# EAGLE design Mutatio_REV2 (EAGLE 7.5.0)
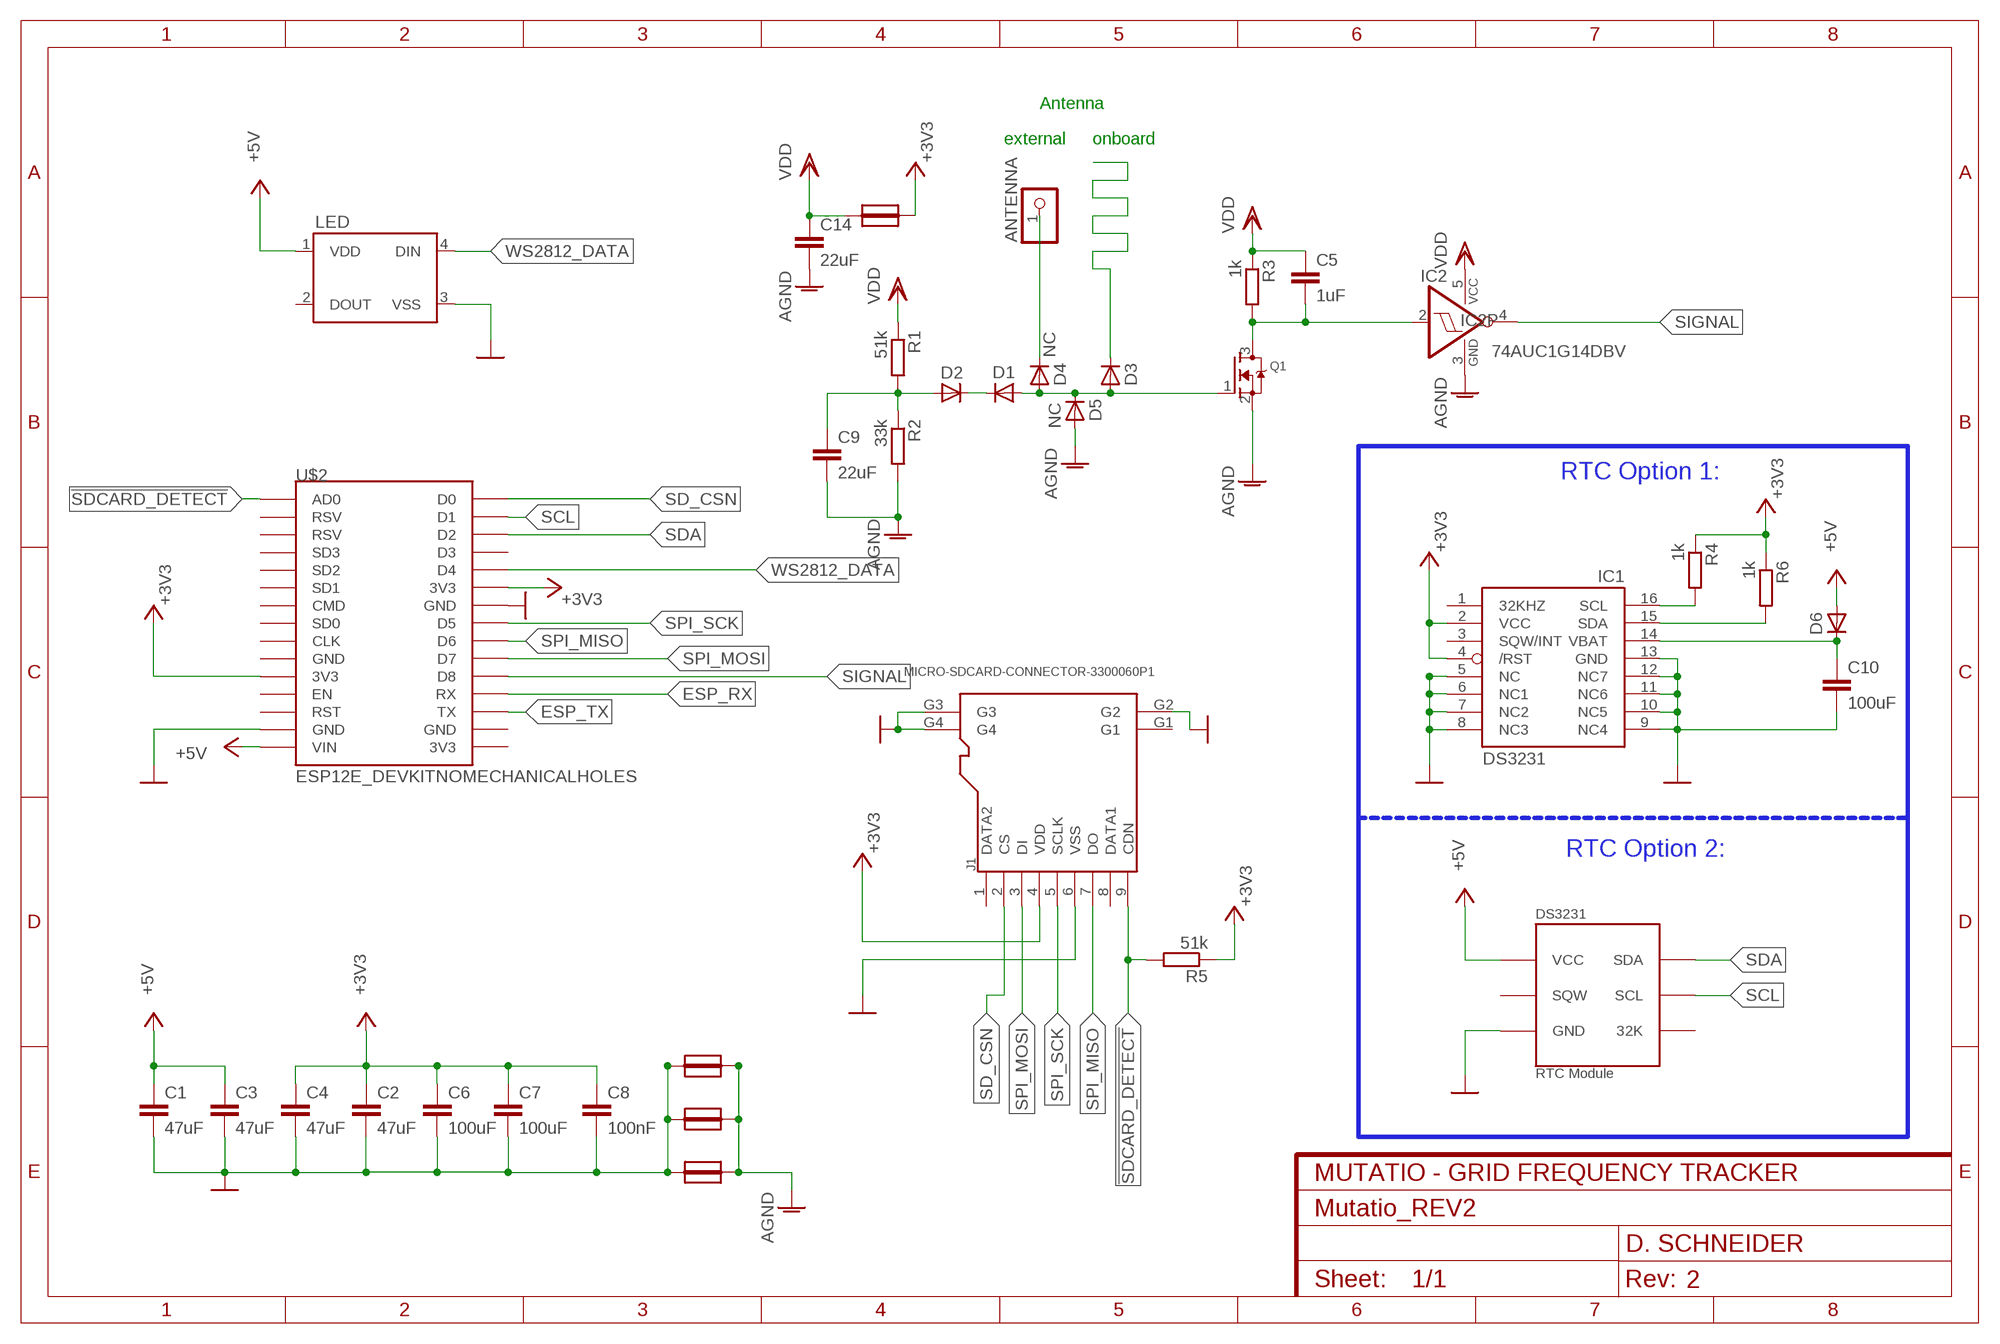
[diagram p0: schematic, sheet 1]
FRAME (FRAME-A4L): CNAME: MUTATIO - GRID FREQUENCY TRACKER; CREVISION: 2; DESIGNER: D. SCHNEIDER

## Parts
ANTENNA  PINHD-1X1CB  [1X01-CLEANBIG]
C1  47uF  C-EUC0805  [C0805]
C2  47uF  C-EUC0805  [C0805]
C3  47uF  C-EUC0805  [C0805]
C4  47uF  C-EUC0805  [C0805]
C5  1uF  C-EUC0603  [C0603]
C6  100uF  C-EUC1206  [C1206]
C7  100uF  C-EUC1206  [C1206]
C8  100nF  C-EUC0603  [C0603]
C9  22uF  C-EUC0603  [C0603]
C10  100uF  C-EUC1206  [C1206]
C14  22uF  C-EUC0603  [C0603]
D1  DIODE-MINIMELF  [MINIMELF]
D2  DIODE-MINIMELF  [MINIMELF]
D3  DIODE-MINIMELF  [MINIMELF]
D4  NC  DIODE-MINIMELF  [MINIMELF]
D5  NC  DIODE-MINIMELF  [MINIMELF]
D6  DIODE-MINIMELF  [MINIMELF]
IC1  DS3231/SO  [SO16W]
IC2  74AUC1G14DBV  [SOT23-5]
J1  MICRO-SDCARD-CONNECTOR-3300060P1  [9P-SMD-W-RING]
LED  WS2812B  [WS2812B]
Q1  MOSFET-NREFLOW  [SOT23]
R1  51k  R-EU_R0603  [R0603]
R2  33k  R-EU_R0603  [R0603]
R3  1k  R-EU_R0603  [R0603]
R4  1k  R-EU_R0603  [R0603]
R5  51k  R-EU_R0603  [R0603]
R6  1k  R-EU_R0603  [R0603]
U$1  DS3231_MODULEBIG_CONNECTER_ONLY  [DS3231_MODULE_BIGCON]
U$2  ESP12E_DEVKITNOMECHANICALHOLES  [ESP12E_DEVKIT_NOHOLES]
U$7  SHORT  [SHORT]
U$8  SHORT  [SHORT]
U$9  SHORT  [SHORT]
U$10  SHORT  [SHORT]

## Nets
!SDCARD_DETECT: J1.9(CDN) R5.2 U$2.AD0
+3V3: C2.1 C4.1 C6.1 C7.1 C8.1 IC1.2(VCC) IC1.4(/RST) J1.4(VDD) R4.1 R5.1 R6.1 U$2.3V3@0(3V3) U$2.3V3@1(3V3) U$7.P$2
+5V: C1.1 C3.1 D6.A LED.1(VDD) U$1.VCC@2(VCC) U$2.VIN
AGND: C9.2 C14.2 D5.A IC2.3(GND) Q1.2(S) R2.2 U$8.P$2 U$9.P$2 U$10.P$2
ANTENNA: D1.A D3.A D4.A D5.C Q1.1(G)
BOARDANTENNA: D3.C
ESP_RX: U$2.RX
ESP_TX: U$2.TX
GND: C1.2 C2.2 C3.2 C4.2 C6.2 C7.2 C8.2 C10.2 IC1.5(NC) IC1.6(NC1) IC1.7(NC2) IC1.8(NC3) IC1.9(NC4) IC1.10(NC5) IC1.11(NC6) IC1.12(NC7) IC1.13(GND) J1.6(VSS) J1.G2 J1.G3 J1.G4 LED.3(VSS) U$1.GND@2(GND) U$2.GND@1(GND) U$2.GND@2(GND) U$8.P$1 U$9.P$1 U$10.P$1
N$1: D1.C D2.C
N$3: ANTENNA.1 D4.C
N$4: C5.2 IC2.2(I) Q1.3(D) R3.2
N$6: C10.1 D6.C IC1.14(VBAT)
REF1: C9.1 D2.A R1.2 R2.1
SCL: IC1.16(SCL) R4.2 U$1.SCL@2(SCL) U$2.D1
SD_CSN: J1.2(CS) U$2.D0
SDA: IC1.15(SDA) R6.2 U$1.SDA@2(SDA) U$2.D2
SIGNAL: IC2.4(O) U$2.D8
SPI_MISO: J1.7(DO) U$2.D6
SPI_MOSI: J1.3(DI) U$2.D7
SPI_SCK: J1.5(SCLK) U$2.D5
VDD: C5.1 C14.1 IC2.5(VCC) R1.1 R3.1 U$7.P$1
WS2812_DATA: LED.4(DIN) U$2.D4
Unconnected: IC1.1(32KHZ) IC1.3(SQW/INT) J1.1(DATA2) J1.8(DATA1) J1.G1 LED.2(DOUT) U$1.32K U$1.SQW U$2.3V3@2(3V3) U$2.CLK U$2.CMD U$2.D3 U$2.EN U$2.GND@0(GND) U$2.GND@3(GND) U$2.RST U$2.RSV@0(RSV) U$2.RSV@1(RSV) U$2.SD0 U$2.SD1 U$2.SD2 U$2.SD3

## Notes on the sheet
- Antenna
- external | onboard
- RTC Option 1:
- RTC Option 2:

## Library data of the parts
ANTENNA = adafruit:PINHD-1X1: Pin header 1x1 for 0.1" spacing With round pins
C1-C10 C14 = resistor:C-EU: CAPACITOR, European symbol
D1-D6 = diode:DIODE-: DIODE
IC1 = adafruit:DS3231
IC2 = 74xx-little-de:74*1G14: Single Schmitt-Trigger Inverter Gate
J1 = OPL Eagle Library:MICRO-SDCARD-CONNECTOR: Micro SD Card
LED = SparkFun-LED:WS2812B: WS2812B - Intelligent control LED integrated light source Technical Specifications: Power Supply Voltage (VDD): 3.5 to 5.3 V Input Voltage (VI): -0.5 to VDD+0.5 V Operating Junction Temperature (Topt): -25°C to +80°C Storage Temperature Range (Tstg): -55°C to +150°C
Q1 = adafruit:MOSFET-N: N-Channel Mosfet 2N7002E - 60V 260mA SOT23 [Digikey: 2N7002ET1GOSTR-ND] - REEL BSH103 - 30V 850mA SOT23 [Digikey: 568-5013-1-ND]
R1-R6 = resistor:R-EU_: RESISTOR, European symbol
U$1 = DS3231_Module:DS3231_MODULE
U$2 = NODEMCU_ESP12E_DEVKIT:ESP12E_DEVKIT: ESP12E DEVKIT BOARD
U$7-U$10 = short_jumper:SHORT

## Board
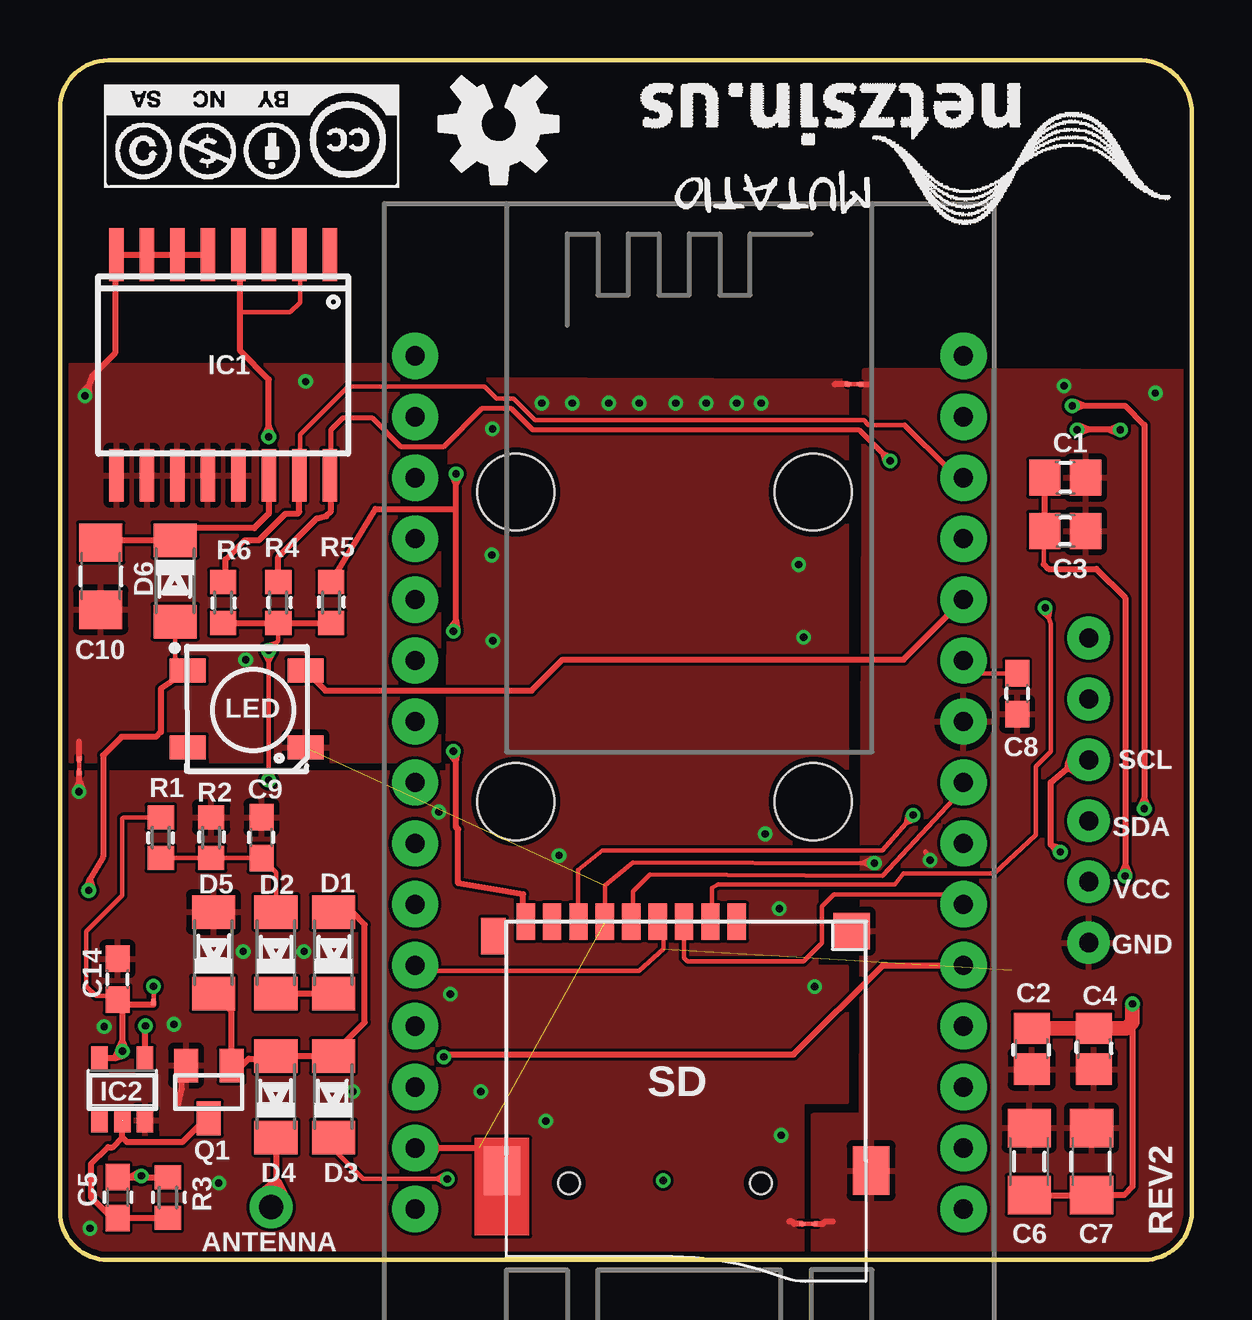
[diagram p1: board, top side]
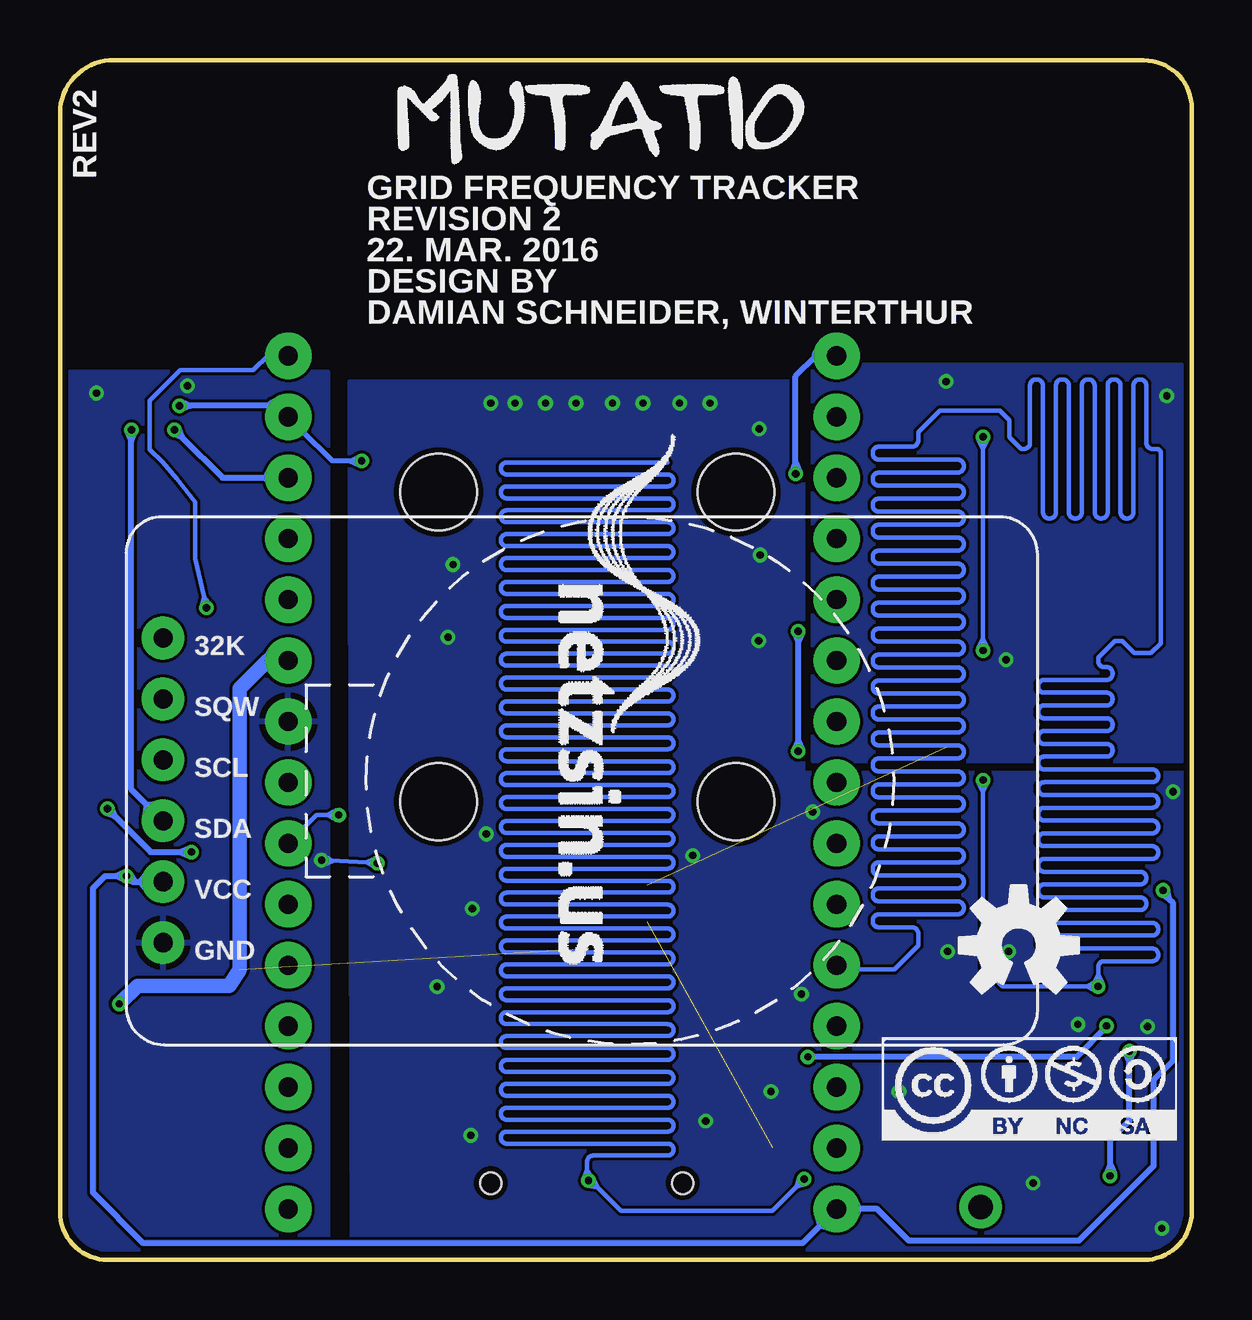
[diagram p2: board, bottom side, seen from below]

Size 47.18 x 50.01 mm. Coordinates in mm from the lower left corner, seen from the top.
Outline: 47.18,2 47.18,48 arc90 44.68,50 2,50 arc90 0,48 0,2 arc90 2,0 45.18,0 arc90 47.18,2
Copper layers (1*16): Top 0.035mm / dielectric 1.5mm / Bottom 0.035mm
Design rules "dirt_cheap_dirty_boards.v1": minimum track width 5mil, minimum drill 12mil, track to track 5mil, track to pad 5mil, pad to pad 5mil, via to via 5mil, smd to smd 0mil, copper to edge 10mil, drill to drill 10mil, minimum pad ring 10mil, minimum via ring 6mil, stop-mask expansion 2mil, vias tented up to drill 25mil, thermal gap 10mil
Holes 3.2 mm at 19,32 31.4,32 31.4,19.1 19,19.1

### Footprints (pad centres in the part's own frame; a part is rotated, then mirrored left to right if it is on the bottom)
1X01-CLEANBIG = drill 1.016 pad 1.778: 1 0,0
C0805 = smd 1.3 x 1.5: 1 -0.85,0; 2 0.85,0
C0603 = smd 1.1 x 1: 1 -0.85,0; 2 0.85,0
C1206 = smd 1.6 x 1.8: 1 -1.4,0; 2 1.4,0
MINIMELF = smd 1.4 x 1.8: A 1.7,0; C -1.7,0
SO16W = smd 0.6 x 2.2: 1 -4.445,-4.6; 2 -3.175,-4.6; 3 -1.905,-4.6; 4 -0.635,-4.6; 5 0.635,-4.6; 6 1.905,-4.6; 7 3.175,-4.6; 8 4.445,-4.6; 9 4.445,4.6; 10 3.175,4.6; 11 1.905,4.6; 12 0.635,4.6; 13 -0.635,4.6; 14 -1.905,4.6; 15 -3.175,4.6; 16 -4.445,4.6
SOT23-5 = smd 0.69 x 0.99: 1 -0.95,-1.29; 2 0,-1.29; 3 0.95,-1.29; 4 0.95,1.3; 5 -0.95,1.3
9P-SMD-W-RING = smd 1.524 x 0.762: 1 -7.493,2.114; 2 -7.493,1.014; 3 -7.493,-0.086; 4 -7.493,-1.186; 5 -7.493,-2.286; 6 -7.493,-3.386; 7 -7.493,-4.486; 8 -7.493,-5.586; 9 -7.493,-6.686 | smd 1.524 x 1.016: G1 -6.893,-8.032 | smd 2.032 x 1.524: G2 2.88,-7.686; G3 2.88,7.714 | smd 1.524 x 1.524: G4 -7.101,6.895 | hole 0.889: 3.407,-4.886; 3.407,3.114
WS2812B = smd 1.5 x 1: 1 -2.45,1.6; 2 -2.45,-1.6; 3 2.45,-1.6; 4 2.45,1.6
SOT23 = smd 1 x 1.4: 1 -0.95,-1.1; 2 0.95,-1.1; 3 0,1.1
R0603 = smd 1 x 1.1: 1 -0.85,0; 2 0.85,0
DS3231_MODULE_BIGCON = drill 0.8 pad 1.778: 32K 5.52,18.68; GND@2 -7.18,18.68; SCL@2 0.44,18.68; SDA@2 -2.1,18.68; SQW 2.98,18.68; VCC@2 -4.64,18.68
ESP12E_DEVKIT_NOHOLES = drill 0.8 pad 1.93: 3V3@0 -11.43,-7.62; 3V3@1 11.43,5.08; 3V3@2 11.43,-17.78; AD0 -11.43,17.78; CLK -11.43,-2.54; CMD -11.43,2.54; D0 11.43,17.78; D1 11.43,15.24; D2 11.43,12.7; D3 11.43,10.16; D4 11.43,7.62; D5 11.43,0; D6 11.43,-2.54; D7 11.43,-5.08; D8 11.43,-7.62; EN -11.43,-10.16; GND@0 -11.43,-5.08; GND@1 -11.43,-15.24; GND@2 11.43,2.54; GND@3 11.43,-15.24; RST -11.43,-12.7; RSV@0 -11.43,15.24; RSV@1 -11.43,12.7; RX 11.43,-10.16; SD0 -11.43,0; SD1 -11.43,5.08; SD2 -11.43,7.62; SD3 -11.43,10.16; TX 11.43,-12.7; VIN -11.43,-17.78
SHORT = smd 0.254 x 0.178: P$1 -0.254,0; P$2 0.254,0

### Placement (x,y rotation side)
ANTENNA  8.8,2.2 0 top
C1  41.9,32.6 0 top
C2  40.5,8.8 270 top
C3  41.9,30.38 0 top
C4  43.1,8.8 270 top
C5  2.4,2.6 270 top
C6  40.4,4.1 90 top
C7  43,4.1 90 top
C8  39.9,23.6 270 top
C9  8.4,17.6 90 top
C10  1.7,28.5 270 top
C14  2.4,11.7 90 top
D1  11.4,12.8 90 top
D2  9,12.8 90 top
D3  11.4,6.8 90 top
D4  9,6.8 90 top
D5  6.4,12.8 90 top
D6  4.8,28.3 270 top
IC1  6.8,37.3 180 top
IC2  2.6,7.1 0 top
J1  26.1,6.6 270 top
LED  7.78,22.96 0 top
Q1  6.2,7 180 top
R1  4.2,17.6 270 top
R2  6.3,17.6 90 top
R3  4.5,2.6 270 top
R4  9.1,27.4 90 top
R5  11.3,27.4 90 top
R6  6.8,27.4 90 top
U$1  24.2,20.4 90 bottom
U$2  26.23,19.9 0 top
U$3  [OSHW-LOGO-M]  18.29,47.35 180 top
U$4  [CC-BY-NC-SA]  14.12,48.97 180 top
U$5  [CC-BY-NC-SA]  12.9,4.99 0 bottom
U$6  [OSHW-LOGO-M]  7.21,13.11 0 bottom
U$7  3.9,11 90 top
U$8  33.1,36.5 180 top
U$9  31.2,1.5 0 top
U$10  0.8,20.6 90 top

### Tracks (layer width: path | path; a pad name or v marks a point on that pad's centre or on a via)
!SDCARD_DETECT  (via drill 0.3)
  Top 0.254: J1.9 19.3,14.2 19.3,15.24 16.6,15.7 16.6,17.94 16.5,18.04 16.5,20.75 | 16.51,31.3 16.51,32.31 | 16.51,32.31 v16.51,32.77 | R5.2 13.15,31.3 16.51,31.3 | 16.5,20.75 16.5,21.1 v16.4,21.2 | v16.4,26.2 16.51,26.31 16.51,26.64 | 16.51,26.64 16.51,31.3 | 16.51,32.31 16.67,32.7 v16.51,32.77 | 16.51,32.31 16.35,32.7 v16.51,32.77 | 16.5,20.75 16.57,21.17 v16.4,21.2 | 16.5,20.75 16.25,21.1 v16.4,21.2 | 16.51,26.64 16.26,26.31 v16.4,26.2 | 16.51,26.64 16.58,26.23 v16.4,26.2
  Bottom 0.254: U$2.AD0 15.6,37.68 15.66,37.68 16.51,36.83 16.51,33.22 | v16.51,32.77 16.51,33.22 | v16.4,21.2 16.4,21.66 | 16.4,21.66 16.4,25.74 | 16.4,25.74 v16.4,26.2 | 16.51,33.22 16.35,32.84 v16.51,32.77 | 16.51,33.22 16.67,32.84 v16.51,32.77 | 16.4,21.66 16.24,21.27 v16.4,21.2 | 16.4,21.66 16.56,21.27 v16.4,21.2 | 16.4,25.74 16.56,26.13 v16.4,26.2 | 16.4,25.74 16.24,26.13 v16.4,26.2
  Bottom 0.508: 15.6,37.68 15.43,38.01 U$2.AD0 15.43,37.35 15.6,37.68
+3V3  (via drill 0.3)  (1 unrouted)
  Top 0.178: U$2.3V3@0 14.8,12.04 15.56,12.04 24.13,12.04 25.15,12.95 25.15,13.86 J1.4 | C8.1 38.26,24.45 38.19,24.45 U$2.3V3@1 | v3.9,11.4 U$7.P$2 | v8.7,25.4 9.02,25.72 | 9.02,25.72 9.1,25.8 R4.1 8.7,26.15 | IC1.2 10,41.88 10,39.9 9.6,39.5 7.5,39.5 | v8.7,20 8.7,20.46 | 8.7,20.46 8.7,24.94 | 8.7,24.94 v8.7,25.4 | 9.02,25.72 8.64,25.61 v8.7,25.4 | 9.02,25.72 8.91,25.34 v8.7,25.4 | 8.7,24.94 8.89,25.3 v8.7,25.4 | 8.7,24.94 8.51,25.3 v8.7,25.4 | 8.7,20.46 8.51,20.1 v8.7,20 | 8.7,20.46 8.89,20.1 v8.7,20
  Top 0.254: 42.7,9.65 C4.1 C2.1 40.6,9.65 42.7,9.65 | 42.7,9.65 44.45,9.65 44.7,9.65 44.7,3.05 44.36,2.7 C7.1 C6.1 | R6.1 R4.1 R5.1 | v8.7,34.3 8.7,34.76 | 8.7,34.76 8.7,36.7 7.5,37.9 7.5,39.5 7.5,41.84 IC1.4 | 10,41.92 IC1.2 | 8.7,34.76 8.54,34.37 v8.7,34.3 | 8.7,34.76 8.86,34.37 v8.7,34.3
  Top 0.356: 15.56,12.04 15.58,12.18 U$2.3V3@0 15.5,11.91 15.56,12.04 | 38.26,24.45 38.33,24.57 U$2.3V3@1 38.15,24.36 38.26,24.45
  Top 0.61: 40.6,9.65 44.45,9.65 44.7,9.91 v44.7,10.67
  Bottom 0.178: v8.7,34.3 8.7,33.84 | 8.7,33.84 8.7,25.86 | 8.7,25.86 v8.7,25.4 | U$2.3V3@0 14.62,12.1 14.02,12.1 12.4,12.1 11.4,13.1 11.4,13.6 arc-90 11.66,13.86 13.04,13.86 arc90 13.3,14.12 13.3,14.14 arc90 13.04,14.4 9.76,14.4 arc-90 9.5,14.66 9.5,14.68 arc-90 9.76,14.94 13.04,14.94 arc90 13.3,15.2 13.3,15.22 arc90 13.04,15.48 9.76,15.48 arc-90 9.5,15.74 9.5,15.77 arc-90 9.76,16.03 13.04,16.03 arc90 13.3,16.29 13.3,16.31 arc90 13.04,16.57 9.76,16.57 arc-90 9.5,16.83 9.5,16.85 arc-90 9.76,17.11 13.04,17.11 arc90 13.3,17.37 13.3,17.39 arc90 13.04,17.65 9.76,17.65 arc-90 9.5,17.91 9.5,17.93 arc-90 9.76,18.19 13.04,18.19 arc90 13.3,18.45 13.3,18.47 arc90 13.04,18.73 9.76,18.73 arc-90 9.5,18.99 9.5,19.02 arc-90 9.76,19.27 13.04,19.27 arc90 13.3,19.54 13.3,19.56 arc90 13.04,19.82 9.76,19.82 arc-90 9.5,20.08 9.5,20.1 arc-90 9.76,20.36 13.04,20.36 arc90 13.3,20.62 13.3,20.64 arc90 13.04,20.9 9.76,20.9 arc-90 9.5,21.16 9.5,21.18 arc-90 9.76,21.44 13.04,21.44 arc90 13.3,21.7 13.3,21.72 arc90 13.04,21.98 9.76,21.98 arc-90 9.5,22.24 9.5,22.26 arc-90 9.76,22.52 13.04,22.52 arc90 13.3,22.78 13.3,22.8 arc90 13.04,23.07 9.76,23.07 arc-90 9.5,23.33 9.5,23.35 arc-90 9.76,23.61 13.04,23.61 arc90 13.3,23.87 13.3,23.89 arc90 13.04,24.15 9.76,24.15 arc-90 9.5,24.41 9.5,24.43 arc-90 9.76,24.69 13.04,24.69 arc90 13.3,24.95 13.3,24.97 arc90 13.04,25.23 9.76,25.23 arc-90 9.5,25.49 9.5,25.51 arc-90 9.76,25.77 13.04,25.77 arc90 13.3,26.03 13.3,26.05 arc90 13.04,26.32 9.76,26.32 arc-90 9.5,26.57 9.5,26.6 arc-90 9.76,26.86 13.04,26.86 arc90 13.3,27.12 13.3,27.14 arc90 13.04,27.4 9.76,27.4 arc-90 9.5,27.66 9.5,27.68 arc-90 9.76,27.94 13.04,27.94 arc90 13.3,28.2 13.3,28.22 arc90 13.04,28.48 9.76,28.48 arc-90 9.5,28.74 9.5,28.76 arc-90 9.76,29.02 13.04,29.02 arc90 13.3,29.28 13.3,29.3 arc90 13.04,29.56 9.76,29.56 arc-90 9.5,29.82 9.5,29.84 arc-90 9.76,30.11 13.04,30.11 arc90 13.3,30.36 13.3,30.39 arc90 13.04,30.65 9.76,30.65 arc-90 9.5,30.91 9.5,30.93 arc-90 9.76,31.19 13.04,31.19 arc90 13.3,31.45 13.3,31.47 arc90 13.04,31.73 9.76,31.73 arc-90 9.5,31.99 9.5,32.01 arc-90 9.76,32.27 13.04,32.27 arc90 13.3,32.53 13.3,32.55 arc90 13.04,32.81 9.76,32.81 arc-90 9.5,33.07 9.5,33.09 arc-90 9.76,33.35 13.04,33.35 arc90 13.3,33.61 13.3,33.63 arc90 13.04,33.9 11.66,33.9 arc-90 11.4,34.16 11.4,34.5 10.5,35.4 8,35.4 7.6,35 7.6,34.3 7.1,33.8 7,33.8 arc-90 6.74,34.06 6.74,36.44 arc90 6.48,36.7 6.46,36.7 arc90 6.2,36.44 6.2,31.16 arc-90 5.94,30.9 5.92,30.9 arc-90 5.66,31.16 5.66,36.44 arc90 5.4,36.7 5.38,36.7 arc90 5.12,36.44 5.12,31.16 arc-90 4.86,30.9 4.85,30.9 arc-90 4.58,31.16 4.58,36.44 arc90 4.33,36.7 4.31,36.7 arc90 4.05,36.44 4.05,31.16 arc-90 3.79,30.9 3.77,30.9 arc-90 3.51,31.16 3.51,36.44 arc90 3.25,36.7 3.23,36.7 arc90 2.97,36.44 2.97,31.16 arc-90 2.71,30.9 2.69,30.9 arc-90 2.43,31.16 2.43,36.44 arc90 2.17,36.7 2.15,36.7 arc90 1.89,36.44 1.89,34.06 arc-90 1.63,33.8 1.4,33.8 1.3,33.7 1.3,25.7 1.7,25.3 2.4,25.3 2.9,25.8 3.2,25.8 3.9,25.1 3.9,24.95 arc-90 3.65,24.71 3.55,24.71 arc90 3.3,24.46 3.3,24.42 arc90 3.55,24.17 6.15,24.17 arc-90 6.4,23.93 6.4,23.89 arc-90 6.15,23.64 3.55,23.64 arc90 3.3,23.39 3.3,23.36 arc90 3.55,23.11 6.15,23.11 arc-90 6.4,22.86 6.4,22.82 arc-90 6.15,22.57 3.55,22.57 arc90 3.3,22.33 3.3,22.29 arc90 3.55,22.04 6.15,22.04 arc-90 6.4,21.79 6.4,21.76 arc-90 6.15,21.51 3.55,21.51 arc90 3.3,21.26 3.3,21.22 arc90 3.55,20.98 6.15,20.98 arc-90 6.4,20.73 6.4,20.69 arc-90 6.15,20.44 1.65,20.44 arc90 1.4,20.2 1.4,20.16 arc90 1.65,19.91 6.15,19.91 arc-90 6.4,19.66 6.4,19.62 arc-90 6.15,19.38 1.65,19.38 arc90 1.4,19.13 1.4,19.09 arc90 1.65,18.84 6.15,18.84 arc-90 6.4,18.6 6.4,18.56 arc-90 6.15,18.31 1.65,18.31 arc90 1.4,18.06 1.4,18.02 arc90 1.65,17.78 6.15,17.78 arc-90 6.4,17.53 6.4,17.49 arc-90 6.15,17.24 1.65,17.24 arc90 1.4,17 1.4,16.96 arc90 1.65,16.71 6.15,16.71 arc-90 6.4,16.46 6.4,16.43 arc-90 6.15,16.18 2.15,16.18 arc90 1.9,15.93 1.9,15.89 arc90 2.15,15.65 6.15,15.65 arc-90 6.4,15.4 6.4,15.36 arc-90 6.15,15.11 2.15,15.11 arc90 1.9,14.87 1.9,14.83 arc90 2.15,14.58 6.15,14.58 arc-90 6.4,14.33 6.4,14.29 arc-90 6.15,14.05 1.65,14.05 arc90 1.4,13.8 1.4,13.76 arc90 1.65,13.51 6.15,13.51 arc-90 6.4,13.27 6.4,13.23 arc-90 6.15,12.98 1.65,12.98 arc90 1.4,12.73 1.4,12.7 arc90 1.65,12.45 3.65,12.45 arc-90 3.9,12.2 3.9,11.86
  Bottom 0.178: 3.9,11.86 v3.9,11.4 | v8.7,20 8.7,19.54 | 8.7,19.54 8.7,12.2 7.9,11.4 4.36,11.4 | 4.36,11.4 v3.9,11.4 | 8.7,33.84 8.89,34.2 v8.7,34.3 | 8.7,33.84 8.51,34.2 v8.7,34.3 | 8.7,25.86 8.51,25.5 v8.7,25.4 | 8.7,25.86 8.89,25.5 v8.7,25.4 | 3.9,11.86 3.71,11.5 v3.9,11.4 | 3.9,11.86 4.09,11.5 v3.9,11.4 | 4.36,11.4 4,11.59 v3.9,11.4 | 4.36,11.4 4,11.21 v3.9,11.4 | 8.7,19.54 8.89,19.9 v8.7,20 | 8.7,19.54 8.51,19.9 v8.7,20
  Bottom 0.356: 14.02,12.1 14.08,11.97 U$2.3V3@0 14.01,12.24 14.02,12.1
  Bottom 0.61: v44.7,10.67 43.94,11.43 40.13,11.43 39.68,12.08 39.68,23.82 38.52,24.98 38.46,24.98 | 38.46,24.98 U$2.3V3@1 | 38.46,24.98 38.2,25.35 U$2.3V3@1 | 38.46,24.98 38.2,24.61 U$2.3V3@1
+5V  (via drill 0.3)
  Top 0.178: C3.1 41,30.33 41,29 | LED.1 4.8,25.09 D6.A
  Top 0.254: C3.1 C1.1 | 41,29 41.2,28.8 43.2,28.8 44.4,27.6 44.4,16.46 | 44.4,16.46 v44.4,16 | LED.1 4.2,23.8 4.2,22 4,21.8 2.57,21.8 1.8,21.03 1.8,16.8 1.23,15.86 | 1.23,15.86 1.2,15.8 v1.2,15.4 | 44.4,16.46 44.24,16.07 v44.4,16 | 44.4,16.46 44.56,16.07 v44.4,16 | 1.23,15.86 1.04,15.48 v1.2,15.4 | 1.23,15.86 1.37,15.46 v1.2,15.4
  Bottom 0.254: v44.4,16 44.16,15.76 44.01,15.76 | 44.01,15.76 43.68,15.76 U$1.VCC@2 | v1.2,15.4 1.2,15.3 0.93,15.03 | 0.93,15.03 0.8,14.9 0.8,8.3 1.6,7.5 1.6,3.9 4.7,0.8 11.8,0.8 13.12,2.12 14,2.12 U$2.VIN 15.37,1.55 16.22,0.7 43.7,0.7 45.8,2.8 45.8,15.5 45.3,16 44.86,16 | 44.86,16 v44.4,16 | 44.01,15.76 44.43,15.82 v44.4,16 | 44.01,15.76 44.26,16.1 v44.4,16 | 44.86,16 44.47,16.16 v44.4,16 | 44.86,16 44.47,15.84 v44.4,16 | 0.93,15.03 1.29,15.25 v1.2,15.4 | 0.93,15.03 1.03,15.44 v1.2,15.4
  Bottom 0.508: U$2.VIN 14.17,1.79 14,2.12 14.17,2.45 U$2.VIN | U$2.VIN 15.48,1.9 15.37,1.55 15.02,1.44 U$2.VIN | 43.68,15.76 43.38,16.15 U$1.VCC@2 43.38,15.37 43.68,15.76
AGND  (via drill 0.3)
  Top 0.254: 4.92,6.45 5.08,7.11 5.08,7.93 Q1.2 | v0.79,19.51 0.8,19.53 0.8,19.97 | 0.8,19.97 0.8,20.35 | U$8.P$2 32.3,36.5 | 30.95,1.5 30.6,1.5 30.5,1.6 30.4,1.6 | 0.8,19.97 0.62,19.59 v0.79,19.51 | 0.8,19.97 0.95,19.58 v0.79,19.51
  other vias: 1.25,1.32 20.08,35.71 21.35,35.71 22.87,35.71 24.14,35.71 25.67,35.71 26.94,35.71 28.21,35.71 29.22,35.71 16.27,11.08 18.05,25.81 18.03,34.64 30.79,28.98 31,25.95 29.99,14.63 17.99,29.38 10.17,12.85 7.63,12.85 6.62,3.2 12.21,7.01 17.54,7.01 31.46,11.39 15.8,18.67 30.06,5.19 20.26,5.79 29.4,17.75 20.8,16.85 1.85,9.72 4.75,9.82
  pour Top: 16.2,20.3 16.3,36.7 16.7,36.7 32.51,36.64 32.77,36.64 32.77,17.78 31.5,17.78 31.5,12.19 32.77,12.19 32.77,6.6 30.9,6.6 30.9,0 0,0 0,20.3
  pour Bottom: 16.2,20.3 16.2,37.2 16.5,36.6 35.1,36.6 35,0 0,0 -0.1,20.3
ANTENNA
  Top 0.254: D1.A 11.42,14.48 12.19,14.48 12.7,13.97 12.7,9.91 11.4,8.61 D3.A D4.A 8.88,8.38 7.87,8.38 7.59,8.1 Q1.1 7.15,10.35 D5.C
BOARDANTENNA  (via drill 0.3)
  Top 0.178: D3.C 11.4,4.6 12.63,3.37 15.69,3.37 | 15.69,3.37 v16.15,3.37 | 15.69,3.37 16.05,3.18 v16.15,3.37 | 15.69,3.37 16.05,3.56 v16.15,3.37
  Bottom 0.178: v16.15,3.37 16.47,3.05 | 16.47,3.05 17.47,2.05 23.8,2.05 24.78,3.03 | 24.78,3.03 25.05,3.3 v25.15,3.3 | v25.15,3.3 25.2,3.3 25.2,3.76 | 21.85,33.24 28.55,33.24 arc-90 28.8,32.99 28.8,32.98 arc-90 28.55,32.74 21.85,32.74 arc90 21.6,32.49 21.6,32.49 arc90 21.85,32.24 28.55,32.24 arc-90 28.8,31.99 28.8,31.99 arc-90 28.55,31.74 21.85,31.74 arc90 21.6,31.49 21.6,31.49 arc90 21.85,31.24 28.55,31.24 arc-90 28.8,31 28.8,30.99 arc-90 28.55,30.75 21.85,30.75 arc90 21.6,30.5 21.6,30.5 arc90 21.85,30.25 28.55,30.25 arc-90 28.8,30 28.8,30 arc-90 28.55,29.75 21.85,29.75 arc90 21.6,29.5 21.6,29.5 arc90 21.85,29.25 28.55,29.25 arc-90 28.8,29 28.8,29 arc-90 28.55,28.75 21.85,28.75 arc90 21.6,28.5 21.6,28.5 arc90 21.85,28.25 28.55,28.25 arc-90 28.8,28.01 28.8,28 arc-90 28.55,27.76 21.85,27.76 arc90 21.6,27.51 21.6,27.51 arc90 21.85,27.26 28.55,27.26 arc-90 28.8,27.01 28.8,27.01 arc-90 28.55,26.76 21.85,26.76 arc90 21.6,26.51 21.6,26.51 arc90 21.85,26.26 28.55,26.26 arc-90 28.8,26.02 28.8,26.01 arc-90 28.55,25.77 21.85,25.77 arc90 21.6,25.52 21.6,25.51 arc90 21.85,25.27 28.55,25.27 arc-90 28.8,25.02 28.8,25.02 arc-90 28.55,24.77 21.85,24.77 arc90 21.6,24.52 21.6,24.52 arc90 21.85,24.27 28.55,24.27 arc-90 28.8,24.02 28.8,24.02 arc-90 28.55,23.77 21.85,23.77 arc90 21.6,23.52 21.6,23.52 arc90 21.85,23.27 28.55,23.27 arc-90 28.8,23.03 28.8,23.02 arc-90 28.55,22.78 21.85,22.78 arc90 21.6,22.53 21.6,22.53 arc90 21.85,22.28 28.55,22.28 arc-90 28.8,22.03 28.8,22.03 arc-90 28.55,21.78 21.85,21.78 arc90 21.6,21.53 21.6,21.53 arc90 21.85,21.28 28.55,21.28 arc-90 28.8,21.03 28.8,21.03 arc-90 28.55,20.78 21.85,20.78 arc90 21.6,20.54 21.6,20.53 arc90 21.85,20.29 28.55,20.29 arc-90 28.8,20.04 28.8,20.04 arc-90 28.55,19.79 21.85,19.79 arc90 21.6,19.54 21.6,19.54 arc90 21.85,19.29 28.55,19.29 arc-90 28.8,19.04 28.8,19.04 arc-90 28.55,18.79 21.85,18.79 arc90 21.6,18.54 21.6,18.54 arc90 21.85,18.29 28.55,18.29 arc-90 28.8,18.05 28.8,18.04 arc-90 28.55,17.8 21.85,17.8 arc90 21.6,17.55 21.6,17.55 arc90 21.85,17.3 28.55,17.3 arc-90 28.8,17.05 28.8,17.05 arc-90 28.55,16.8 21.85,16.8 arc90 21.6,16.55 21.6,16.55 arc90 21.85,16.3 28.55,16.3 arc-90 28.8,16.05 28.8,16.05 arc-90 28.55,15.8 21.85,15.8 arc90 21.6,15.56 21.6,15.55 arc90 21.85,15.3 28.55,15.3 arc-90 28.8,15.06 28.8,15.05 arc-90 28.55,14.81 21.85,14.81 arc90 21.6,14.56 21.6,14.56 arc90 21.85,14.31 28.55,14.31 arc-90 28.8,14.06 28.8,14.06 arc-90 28.55,13.81 21.85,13.81 arc90 21.6,13.56 21.6,13.56 arc90 21.85,13.31 28.55,13.31 arc-90 28.8,13.06 28.8,13.06 arc-90 28.55,12.81 21.85,12.81 arc90 21.6,12.57 21.6,12.56 arc90 21.85,12.32 28.55,12.32 arc-90 28.8,12.07 28.8,12.07 arc-90 28.55,11.82 21.85,11.82 arc90 21.6,11.57 21.6,11.57 arc90 21.85,11.32 28.55,11.32 arc-90 28.8,11.07 28.8,11.07 arc-90 28.55,10.82 21.85,10.82 arc90 21.6,10.57 21.6,10.57 arc90 21.85,10.32 28.55,10.32 arc-90 28.8,10.08 28.8,10.07 arc-90 28.55,9.83 21.85,9.83 arc90 21.6,9.58 21.6,9.58 arc90 21.85,9.33 28.55,9.33 arc-90 28.8,9.08 28.8,9.08 arc-90 28.55,8.83 21.85,8.83 arc90 21.6,8.58 21.6,8.58 arc90 21.85,8.33 28.55,8.33 arc-90 28.8,8.09 28.8,8.08 arc-90 28.55,7.83 21.85,7.83 arc90 21.6,7.59 21.6,7.58 arc90 21.85,7.34 28.55,7.34 arc-90 28.8,7.09 28.8,7.09 arc-90 28.55,6.84 21.85,6.84 arc90 21.6,6.59 21.6,6.59 arc90 21.85,6.34 28.55,6.34 arc-90 28.8,6.09 28.8,6.09 arc-90 28.55,5.84 21.85,5.84 arc90 21.6,5.59 21.6,5.59 arc90 21.85,5.34 28.55,5.34 arc-90 28.8,5.1 28.8,5.09 arc-90 28.55,4.85 21.85,4.85 arc90 21.6,4.6 21.6,4.59 arc90 21.85,4.35 24.95,4.35 arc-90 25.2,4.1 25.2,3.76
  Bottom 0.178: 24.78,3.03 25.18,3.09 v25.15,3.3 | 24.78,3.03 24.95,3.39 v25.15,3.3 | 25.2,3.76 24.97,3.43 v25.15,3.3 | 25.2,3.76 25.35,3.38 v25.15,3.3 | 16.47,3.05 16.36,3.43 v16.15,3.37 | 16.47,3.05 16.09,3.16 v16.15,3.37
GND  (via drill 0.3)  (2 unrouted)
  Top 0.178: J1.6 22.71,15.6 23.88,16.56 v33.95,16.53 | v36.27,16.66 36.07,17.02 | v33.95,16.53 33.84,16.34 33.49,16.54 33.84,16.73 v33.95,16.53
  Top 0.254: U$2.GND@1 15.6,4.66 17.47,4.66 J1.G2 | IC1.5 IC1.6 IC1.7 IC1.8 2.3,41.84 2.3,37.8 1.34,36.84 1.2,36.44 | 1.2,36.44 v1.04,36.01 | 0.8,20.85 0.8,21.6 | U$8.P$1 33.8,36.5 | 31.45,1.5 31.8,1.5 31.9,1.6 32.2,1.6 | 1.2,36.44 0.91,36.13 v1.04,36.01 | 1.2,36.44 1.22,36.02 v1.04,36.01
  Top 0.508: 15.6,4.66 15.43,4.99 U$2.GND@1 15.43,4.33 15.6,4.66
  Bottom 0.178: v33.95,16.53 34.4,16.56 | 34.4,16.56 v36.27,16.66 | 34.4,16.56 34.04,16.73 v33.95,16.53 | 34.4,16.56 34.06,16.35 v33.95,16.53 | v36.27,16.66 36.18,16.47 35.81,16.64 36.16,16.85 v36.27,16.66
  other vias: 41.86,36.43 10.24,36.61 7.74,25.01 45.66,36.13
  pour Top: 31.4,6 31.4,0 47,0 47,37 33.54,37.06 33.4,6
  pour Bottom: 36,37 36,0 47,0 47,37
  pour Bottom: 0.4,37.3 0.4,20.8 15.8,20.8 15.8,37.3
  pour Top: 15.8,37.3 15.8,20.8 0.4,20.8 0.4,37.3
N$1
  Top 0.254: D2.C D1.C
N$3
  Top 0.254: D4.C 9,3.2 9,2.4 ANTENNA.1
  Top 0.508: 9,3.2 8.39,2.69 ANTENNA.1 9.36,2.49 9,3.2
N$4
  Top 0.254: R3.2 C5.2 2.15,1.75 1.3,2.6 1.3,4 2,4.7 2.2,4.7 2.6,5.1 | 2.6,5.1 IC2.2 | Q1.3 6.1,5.9 5.1,4.9 2.8,4.9 2.6,5.1
N$6
  Top 0.254: C10.1 1.8,30 D6.C 4.8,30.3 5,30.5 8.1,30.5 8.7,31.1 IC1.14
REF1
  Top 0.178: R1.2 R2.1 C9.1 9,16.15 D2.A
SCL  (via drill 0.3)
  Top 0.203: 11.3,32.65 11.3,34.6 11.8,35.1 13,35.1 14.2,33.9 16,33.9 17.6,35.5 18.8,35.5 19.7,34.6 33.3,34.6 34.28,33.62 | 34.28,33.62 v34.6,33.3 | 34.28,33.62 34.41,33.23 v34.6,33.3 | 34.28,33.62 34.66,33.49 v34.6,33.3
  Top 0.254: v42.2,35.6 42.66,35.6 | 42.66,35.6 44.4,35.6 45.2,34.8 45.2,19.26 | 45.2,19.26 v45.2,18.8 | v41.7,17 41.33,17.27 | 41.33,17.27 41.3,17.3 41.3,19.9 42.12,20.58 42.44,20.84 U$1.SCL@2 | R4.2 9.1,29.3 10.7,30.9 11.1,31 11.3,31.2 11.3,32.65 IC1.16 | 42.66,35.6 42.27,35.76 v42.2,35.6 | 42.66,35.6 42.27,35.44 v42.2,35.6 | 45.2,19.26 45.04,18.87 v45.2,18.8 | 45.2,19.26 45.36,18.87 v45.2,18.8 | 41.33,17.27 41.55,16.91 v41.7,17 | 41.33,17.27 41.74,17.17 v41.7,17
  Top 0.508: 42.12,20.58 42.53,20.31 U$1.SCL@2 42.28,21.04 42.12,20.58
  Bottom 0.203: v34.6,33.3 35.06,33.3 | 35.06,33.3 35.82,33.3 37.09,34.57 U$2.D1 | 35.06,33.3 34.69,33.48 v34.6,33.3 | 35.06,33.3 34.69,33.12 v34.6,33.3
  Bottom 0.254: U$2.D1 38.12,35.6 38.31,35.6 41.74,35.6 | 41.74,35.6 v42.2,35.6 | v45.2,18.8 44.88,18.48 | 44.88,18.48 43.4,17 42.16,17 | 42.16,17 v41.7,17 | 41.74,35.6 42.13,35.44 v42.2,35.6 | 41.74,35.6 42.13,35.76 v42.2,35.6 | 44.88,18.48 45.27,18.64 v45.2,18.8 | 44.88,18.48 45.03,18.87 v45.2,18.8 | 42.16,17 41.77,17.16 v41.7,17 | 42.16,17 41.77,16.84 v41.7,17
  Bottom 0.406: 37.09,34.57 37.31,34.46 U$2.D1 36.98,34.79 37.09,34.57
  Bottom 0.508: 38.31,35.6 37.99,35.77 U$2.D1 38.37,35.24 38.31,35.6
SD_CSN  (via drill 0.3)
  Top 0.178: J1.2 27.18,14.16 27.18,15.49 27.43,15.65 34.8,15.65 35.15,16.1 38.95,16.1 40.67,17.72 40.67,20.57 41.3,21.2 41.3,26.5 41.22,26.75 | 41.22,26.75 41.1,27.1 v41.07,27.18 | 41.22,26.75 41.28,27.14 v41.07,27.18 | 41.22,26.75 40.92,27.02 v41.07,27.18
  Bottom 0.178: v41.07,27.18 41.17,27.63 | 41.17,27.63 41.53,29.24 41.53,31.6 42.31,32.57 42.93,33.27 43.43,33.78 43.43,35.81 42.16,37.08 39.12,37.08 38.46,37.74 38.35,37.85 37.85,37.85 37.76,37.68 U$2.D0 | 41.17,27.63 40.91,27.32 v41.07,27.18 | 41.17,27.63 41.28,27.24 v41.07,27.18
  Bottom 0.356: 38.46,37.74 38.42,37.88 U$2.D0 38.44,37.6 38.46,37.74
SDA  (via drill 0.3)
  Top 0.178: IC1.15 10,32.73 10,34.4 12,36.4 17.7,36.4 18.2,35.9 18.9,35.9 19.8,35 33.5,35 33.7,34.8 35.2,34.8
  Top 0.203: 35.2,34.8 36.98,33.02 37.4,32.6 U$2.D2
  Top 0.254: v44.2,34.6 43.74,34.6 | 43.74,34.6 42.86,34.6 | 42.86,34.6 v42.4,34.6 | R6.2 6.9,28.35 6.9,29.2 7.7,30 8.3,30 9.4,31.1 9.9,31.1 9.97,31.18 IC1.15 | 43.74,34.6 44.13,34.44 v44.2,34.6 | 43.74,34.6 44.13,34.76 v44.2,34.6 | 42.86,34.6 42.47,34.76 v42.4,34.6 | 42.86,34.6 42.47,34.44 v42.4,34.6
  Top 0.406: 36.98,33.02 36.92,32.78 U$2.D2 37.16,33.18 36.98,33.02
  Bottom 0.254: U$1.SDA@2 42.98,18.4 43.2,18.6 43.46,18.86 44.2,19.6 44.2,34.14 | 44.2,34.14 v44.2,34.6 | v42.4,34.6 42.08,34.28 | 42.08,34.28 40.4,32.6 38.46,32.6 U$2.D2 | 44.2,34.14 44.36,34.53 v44.2,34.6 | 44.2,34.14 44.04,34.53 v44.2,34.6 | 42.08,34.28 42.47,34.44 v42.4,34.6 | 42.08,34.28 42.23,34.67 v42.4,34.6
  Bottom 0.508: 38.46,32.6 38.29,32.93 U$2.D2 38.29,32.27 38.46,32.6 | 43.46,18.86 42.97,18.93 U$1.SDA@2 43.51,18.37 43.46,18.86
SIGNAL  (via drill 0.3)
  Top 0.254: IC2.4 v3.55,9.75 v3.56,9.75 | v16,8.46 16.1,8.56 30.58,8.56 34.3,12.28 U$2.D8
  Bottom 0.254: v3.56,9.75 3.56,9.7 4.8,8.46 v16,8.46
SPI_MISO  (via drill 0.3)
  Top 0.178: v35.56,18.54 35.26,18.2 | 35.26,18.2 34.29,17.07 22.61,17.07 21.59,16.26 21.59,14.12 J1.7 | 35.26,18.2 35.64,18.34 v35.56,18.54 | 35.26,18.2 35.35,18.59 v35.56,18.54
  Bottom 0.178: U$2.D6 37.09,17.93 36.48,18.54 36.02,18.54 | 36.02,18.54 v35.56,18.54 | 36.02,18.54 35.66,18.73 v35.56,18.54 | 36.02,18.54 35.66,18.35 v35.56,18.54
  Bottom 0.356: 37.09,17.93 37.01,17.81 U$2.D6 37.21,18.01 37.09,17.93
SPI_MOSI
  Top 0.178: J1.3 26.01,12.59 26.16,12.45 30.99,12.45 31.75,13.21 31.75,14.73 32.26,15.24 36.98,15.24 37.24,15.24 U$2.D7
  Top 0.356: 36.98,15.24 36.93,15.11 U$2.D7 37.07,15.35 36.98,15.24
SPI_SCK
  Top 0.178: U$2.D5 37.66,19.63 37.27,19.2 34.28,16.01 24.58,16.06 23.88,15.35 23.88,14.15 J1.5
  Top 0.356: 37.27,19.2 37.4,19.16 U$2.D5 37.16,19.29 37.27,19.2
VDD  (via drill 0.3)
  Top 0.178: C14.1 2.25,11 1.5,11 1.1,11.4 1.1,13.7 2.6,15.2 2.6,18.4 2.65,18.45 R1.1 | C5.1 2.45,3.5 2.94,3.5 | 2.94,3.5 v3.4,3.5 | 2.94,3.5 3.3,3.31 v3.4,3.5 | 2.94,3.5 3.3,3.69 v3.4,3.5
  Top 0.254: C5.1 R3.1 | v2.6,8.7 2.3,8.4 2.25,8.4 | 2.25,8.4 IC2.5 | C14.1 2.6,10.65 | 2.6,10.65 2.6,9.16 | 2.6,9.16 v2.6,8.7 | 2.6,10.65 3.9,10.65 U$7.P$1 | 2.25,8.4 2.65,8.53 v2.6,8.7 | 2.25,8.4 2.44,8.78 v2.6,8.7 | 2.6,9.16 2.44,8.77 v2.6,8.7 | 2.6,9.16 2.76,8.77 v2.6,8.7
  Bottom 0.254: v3.4,3.5 3.4,3.96 | 3.4,3.96 3.4,5 2.6,5.8 2.6,8.24 | 2.6,8.24 v2.6,8.7 | 3.4,3.96 3.24,3.57 v3.4,3.5 | 3.4,3.96 3.56,3.57 v3.4,3.5 | 2.6,8.24 2.76,8.63 v2.6,8.7 | 2.6,8.24 2.44,8.63 v2.6,8.7
WS2812_DATA
  Top 0.254: LED.4 11.07,23.72 19.66,23.72 20.95,25.02 35.16,25.02 U$2.D4
(copper drawn outside any net)
  shapes: Top area x1

### Text on the board
tNames: SCL | SDA | VCC | GND | SD | REV2
bNames: REV2 | GRID FREQUENCY TRACKER | REVISION 2 | 22. MAR. 2016 | DESIGN BY | DAMIAN SCHNEIDER, WINTERTHUR